# EAGLE schematic qfn32-36 (EAGLE 7.7.0)
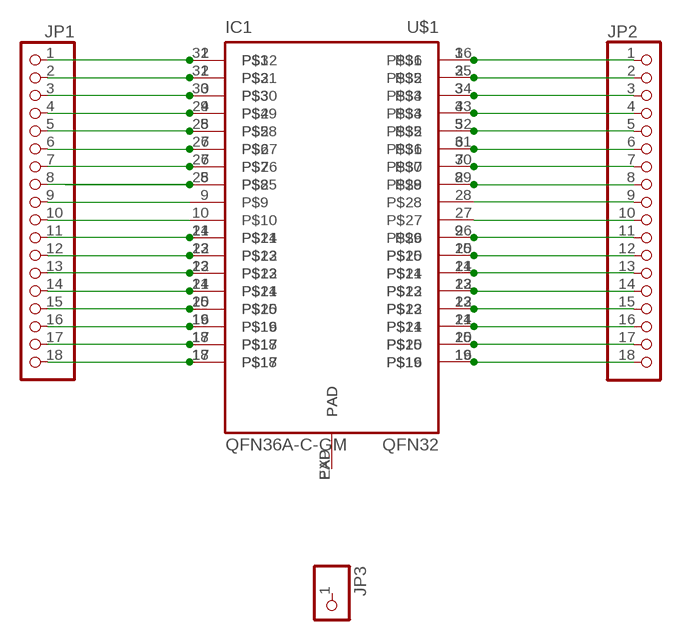
[diagram p0: schematic, sheet 1]

## Parts
IC1  QFN36A-C-GM  [QFN36-6X6]
JP1  PINHD-1X18-BIG  [1X18-BIG]
JP2  PINHD-1X18-BIG  [1X18-BIG]
JP3  PINHD-1X1  [1X01]
U$1  QFN32  [QFN32-5X5]

## Nets
N$1: IC1.1 JP1.1 U$1.32
N$2: IC1.2 JP1.2 U$1.31
N$3: IC1.3 JP1.3 U$1.30
N$4: IC1.4 JP1.4 U$1.29
N$5: IC1.5 JP1.5 U$1.28
N$6: IC1.6 JP1.6 U$1.27
N$7: IC1.7 JP1.7 U$1.26
N$8: IC1.8 JP1.8 U$1.25
N$9: IC1.10 JP1.10
N$10: IC1.9 JP1.9
N$11: IC1.11 JP1.11 U$1.24
N$12: IC1.12 JP1.12 U$1.23
N$13: IC1.13 JP1.13 U$1.22
N$14: IC1.14 JP1.14 U$1.21
N$15: IC1.15 JP1.15 U$1.20
N$16: IC1.16 JP1.16 U$1.19
N$17: IC1.17 JP1.17 U$1.18
N$18: IC1.18 JP1.18 U$1.17
N$19: IC1.36 JP2.1 U$1.1
N$20: IC1.35 JP2.2 U$1.2
N$21: IC1.34 JP2.3 U$1.3
N$22: IC1.33 JP2.4 U$1.4
N$23: IC1.32 JP2.5 U$1.5
N$24: IC1.31 JP2.6 U$1.6
N$25: IC1.30 JP2.7 U$1.7
N$26: IC1.29 JP2.8 U$1.8
N$27: IC1.28 JP2.9
N$28: IC1.27 JP2.10
N$29: IC1.26 JP2.11 U$1.9
N$30: IC1.25 JP2.12 U$1.10
N$31: IC1.24 JP2.13 U$1.11
N$32: IC1.23 JP2.14 U$1.12
N$33: IC1.22 JP2.15 U$1.13
N$34: IC1.21 JP2.16 U$1.14
N$35: IC1.19 JP2.18 U$1.16
N$36: IC1.20 JP2.17 U$1.15
Unconnected: IC1.EXP(PAD) JP3.1 U$1.PAD

## Library data of the parts
IC1 = qfn packages:QFN36: Pin-Controlled 1–711 MHz Jitter Cleaning Clock Source: http://www.silabs.com/Support%20Documents/TechnicalDocs/Si5317.pdf; MF: Silicon Labs; MPN: Si5317A-C-GM; OC_FARNELL: unknown; OC_NEWARK: unknown
JP1 JP2 = adafruit:PINHD-1X18: PIN HEADER
JP3 = adafruit:PINHD-1X1: Pin header 1x1 for 0.1" spacing With round pins
U$1 = qfn packages:QFN32